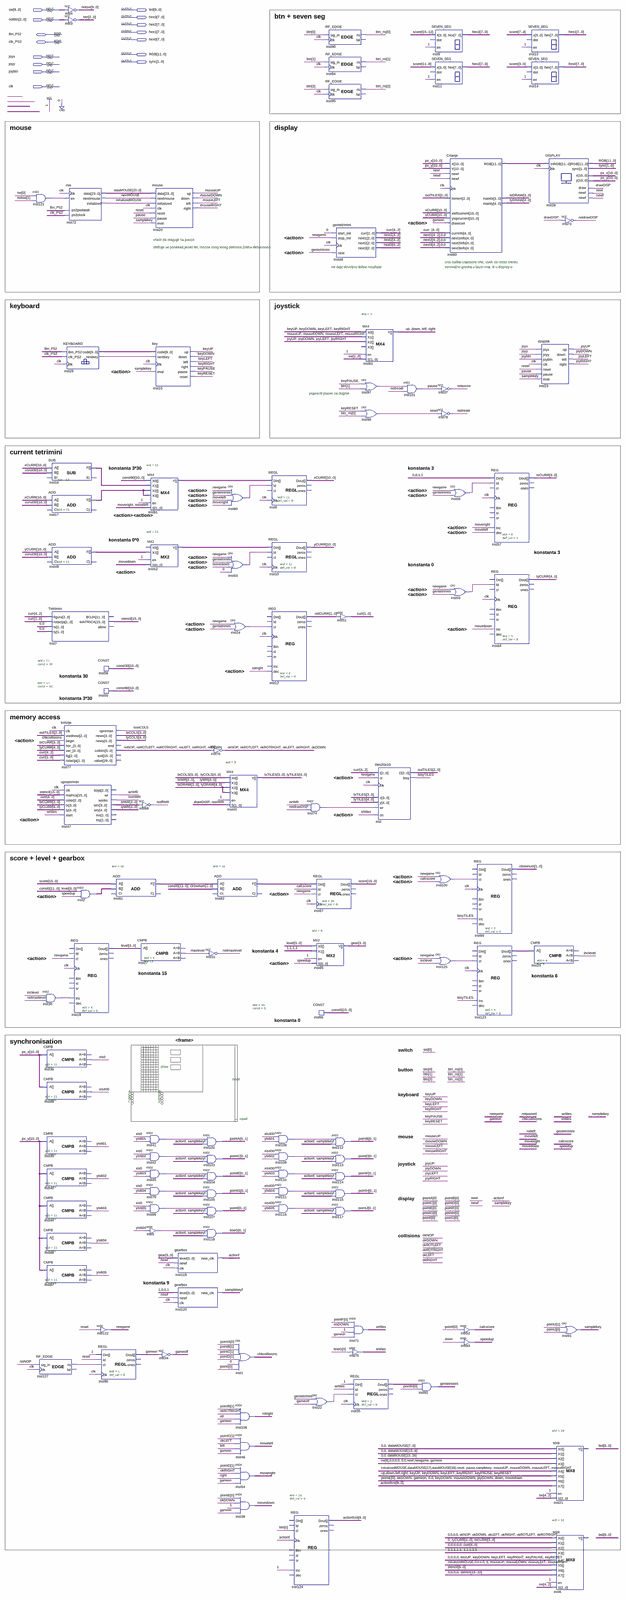
[diagram p0: schematic sheet, whole]
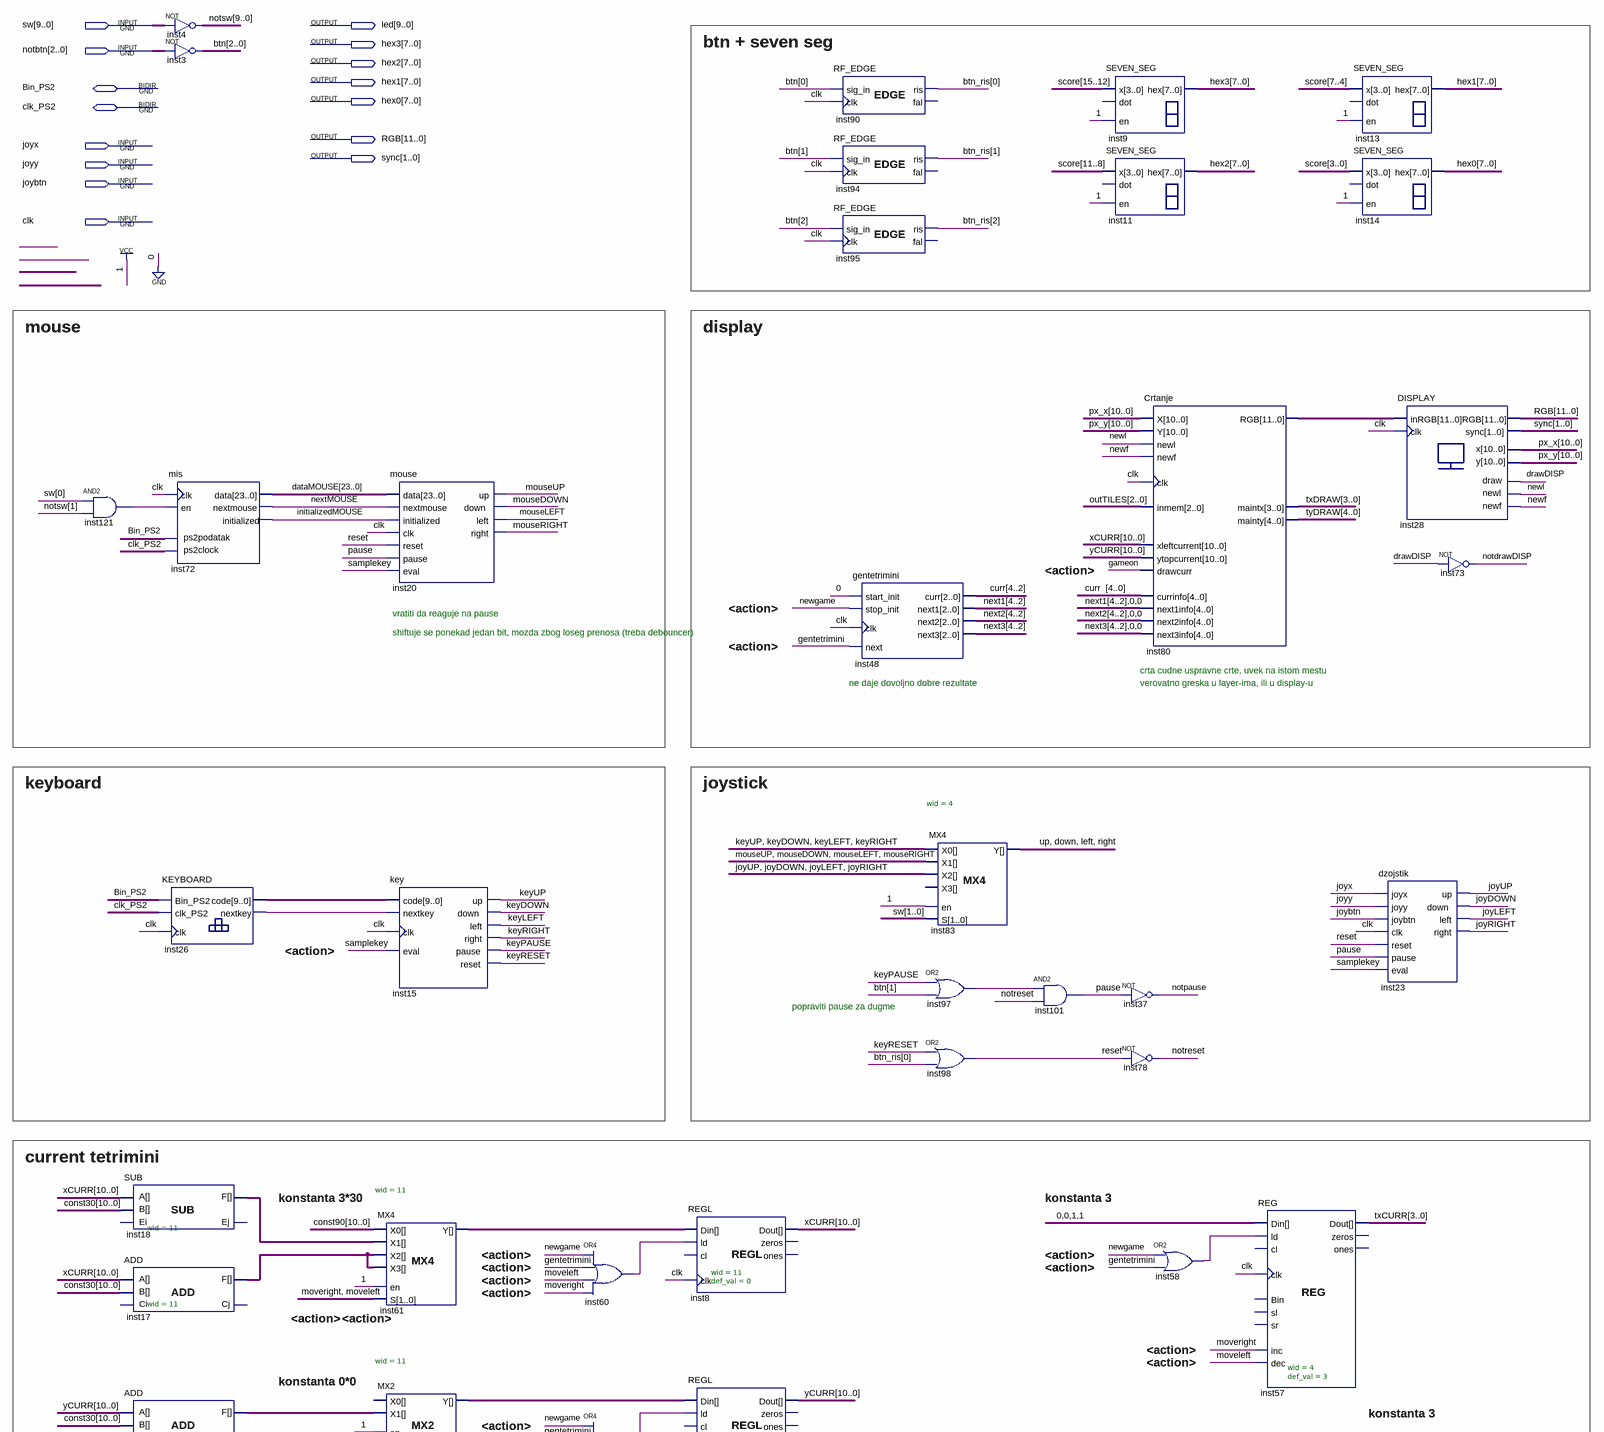
[diagram p1: schematic sheet, upper part]
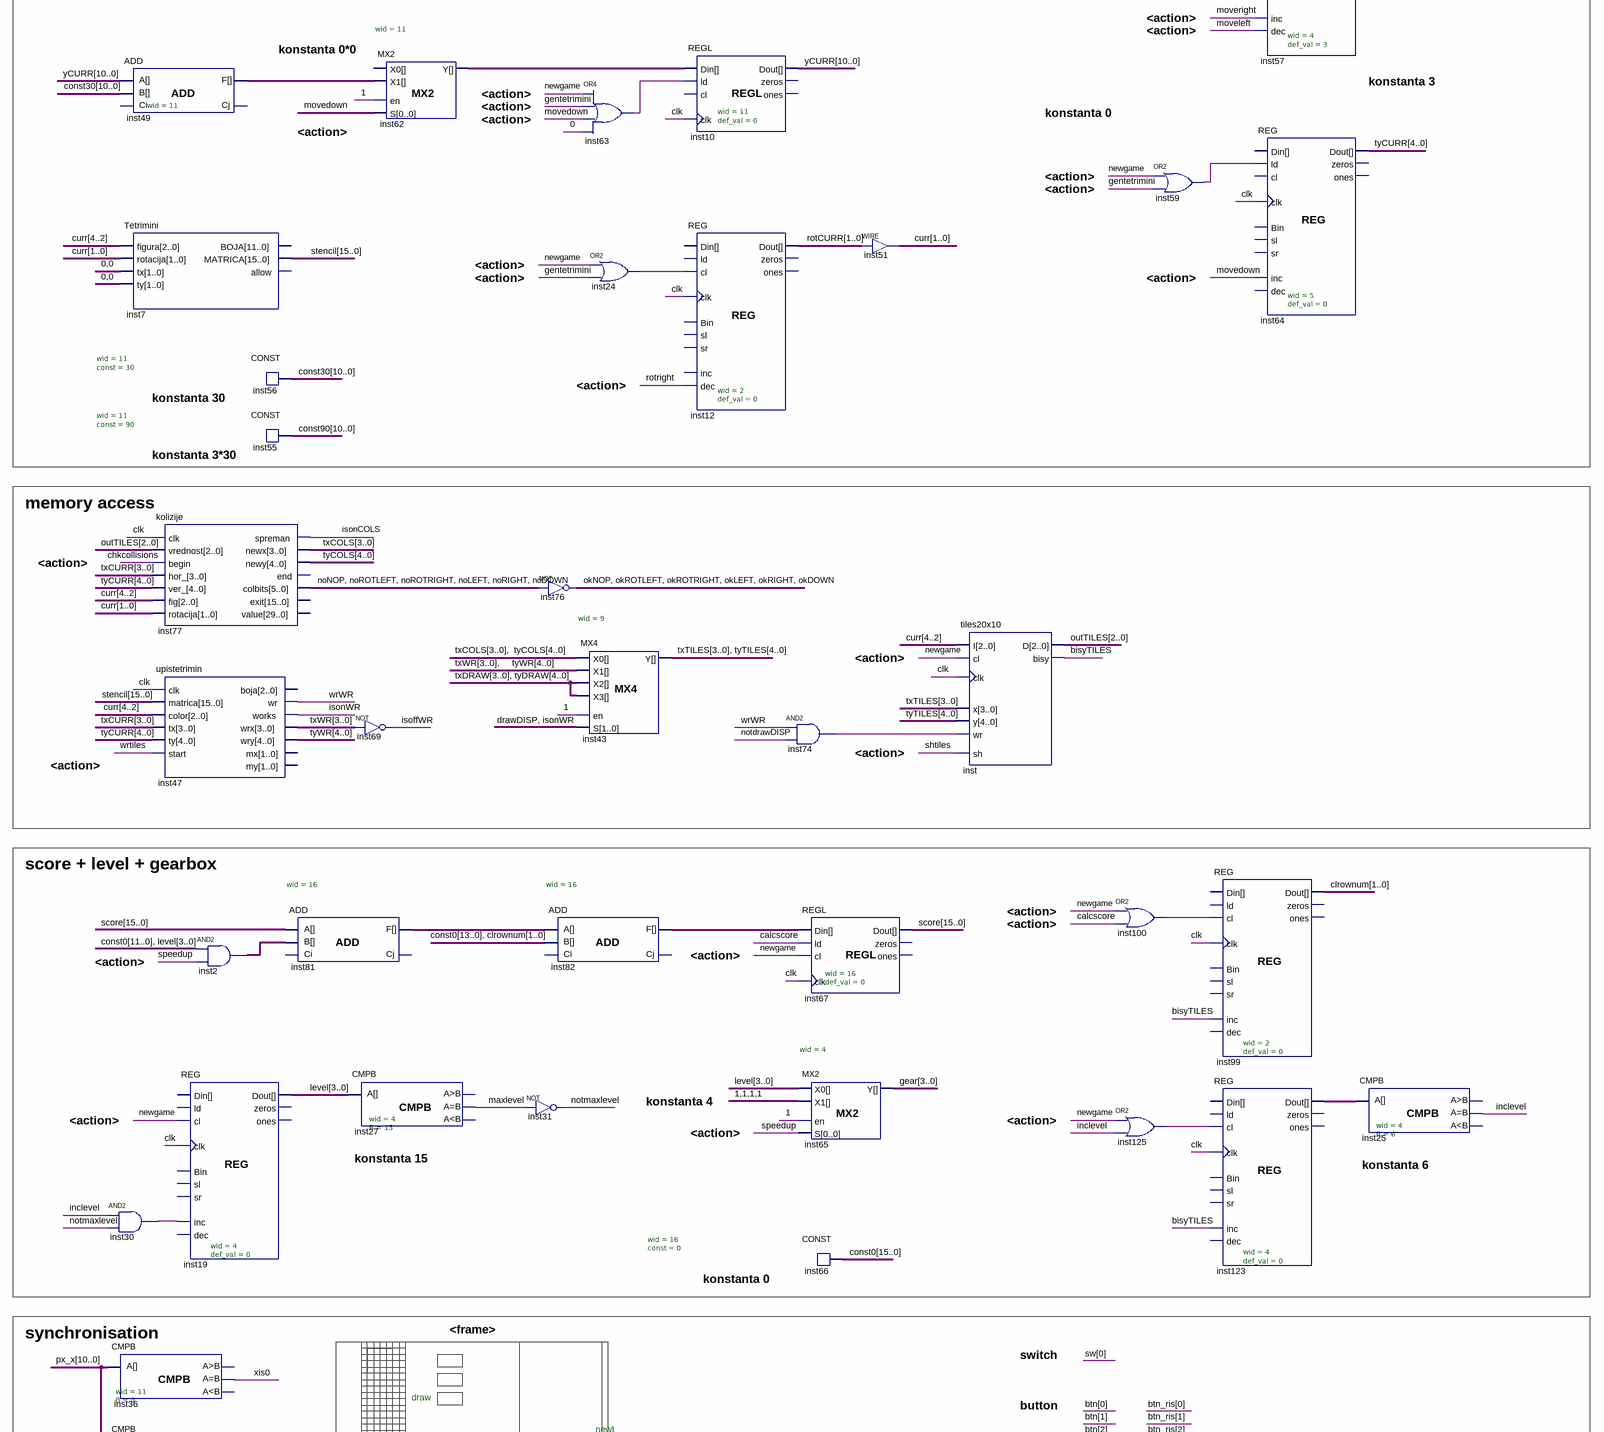
[diagram p2: schematic sheet, middle part]
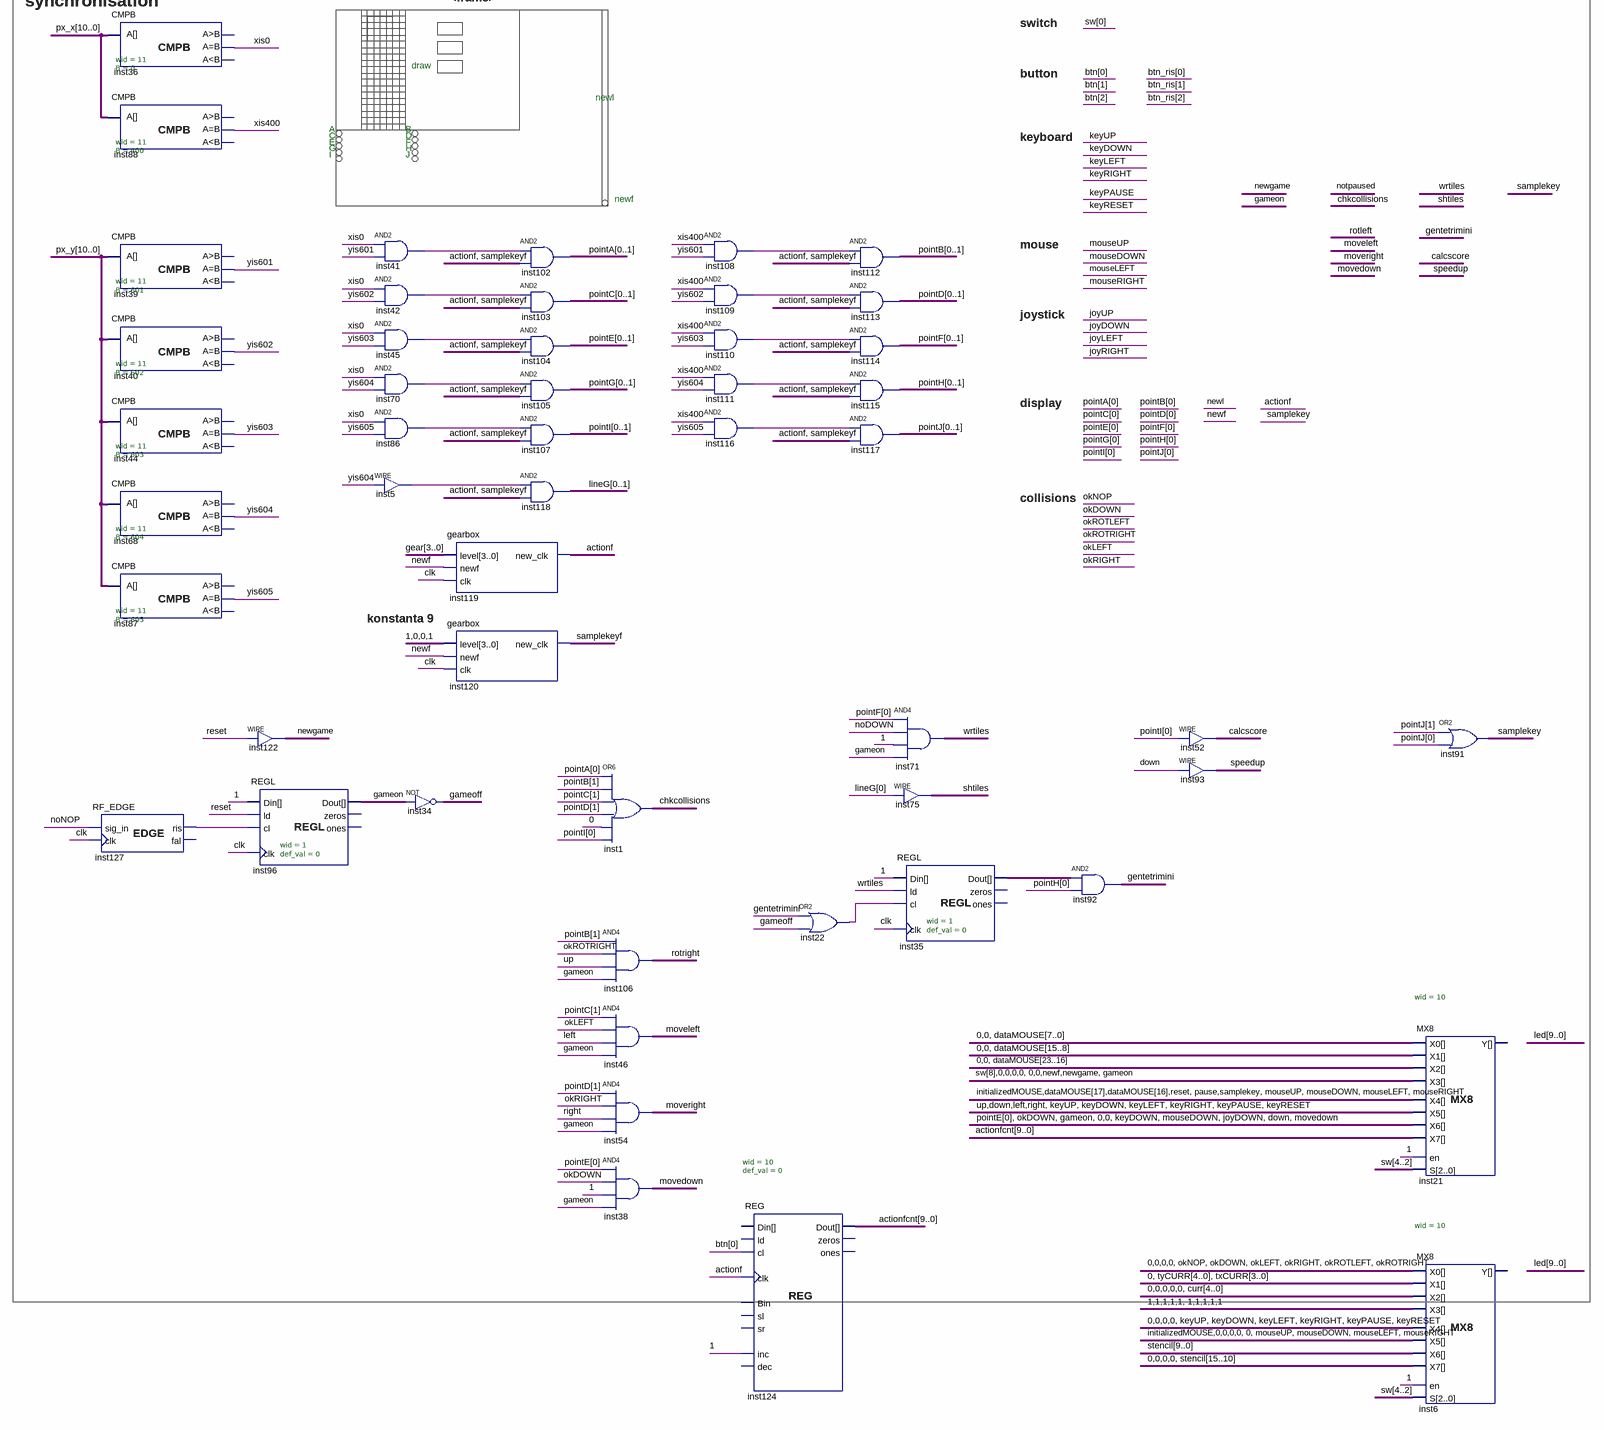
[diagram p3: schematic sheet, lower part]
// Quartus schematic main.bdf as structural Verilog: 117 symbols, 15 pins
module main (
  input  [9:0] sw,
  input  [2:0] notbtn,
  input  joyx,
  input  joyy,
  input  joybtn,
  input  clk,
  inout  Bin_PS2,
  inout  clk_PS2,
  output [9:0] led,
  output [7:0] hex3,
  output [7:0] hex2,
  output [7:0] hex1,
  output [7:0] hex0,
  output [11:0] RGB,
  output [1:0] sync
);

  wire actionf, bisyTILES, calcscore, chkcollisions, down, drawDISP, gameoff, gameon, gentetrimini, inclevel,
       initializedMOUSE, inst5_out, inst22_out, inst24_out, inst26_nextkey, inst30_out, inst35_dout,
       inst41_out, inst42_out, inst45_out, inst58_out, inst59_out, inst60_out, inst63_out, inst70_out,
       inst74_out, inst86_out, inst97_out, inst100_out, inst108_out, inst109_out, inst110_out, inst111_out,
       inst116_out, inst121_out, inst125_out, inst127_ris, isoffWR, isonCOLS, isonWR, joyDOWN, joyLEFT,
       joyRIGHT, joyUP, keyDOWN, keyLEFT, keyPAUSE, keyRESET, keyRIGHT, keyUP, left, maxlevel, mouseDOWN,
       mouseLEFT, mouseRIGHT, mouseUP, movedown, moveleft, moveright, newf, newgame, newl, nextMOUSE, noDOWN,
       noLEFT, noNOP, noRIGHT, noROTLEFT, noROTRIGHT, notdrawDISP, notmaxlevel, notpause, notreset, okDOWN,
       okLEFT, okNOP, okRIGHT, okROTLEFT, okROTRIGHT, pause, reset, right, rotright, samplekey, samplekeyf,
       shtiles, speedup, up, wrtiles, wrWR, xis0, xis400, yis601, yis602, yis603, yis604, yis605;
  wire [1:0] clrownum, lineG, pointA, pointB, pointC, pointD, pointE, pointF, pointG, pointH, pointI, pointJ,
       rotCURR;
  wire [2:0] btn, btn_ris, outTILES;
  wire [3:0] gear, inst123_dout, level, txCOLS, txCURR, txDRAW, txTILES, txWR;
  wire [4:0] curr, tyCOLS, tyCURR, tyDRAW, tyTILES, tyWR;
  wire [4:2] next1, next2, next3;
  wire [9:0] actionfcnt, inst26_code, notsw;
  wire [10:0] const30, const90, inst17_f, inst18_f, inst49_f, inst61_y, inst62_y, px_x, px_y, xCURR, yCURR;
  wire [11:0] inst80_rgb;
  wire [15:0] const0, inst2_out, inst81_f, inst82_f, score, stencil;
  wire [23:0] dataMOUSE;

  and inst121 (inst121_out, sw[0], notsw[1]);
  RF_EDGE inst127 (.sig_in(noNOP), .clk(clk), .ris(inst127_ris));  // open: fal
  SUB #(.wid(11)) inst18 (.A(xCURR), .B(const30), .F(inst18_f));  // open: Ei, Ej
  ADD #(.wid(11)) inst17 (.A(xCURR), .B(const30), .F(inst17_f));  // open: Ci, Cj
  ADD #(.wid(11)) inst49 (.A(yCURR), .B(const30), .F(inst49_f));  // open: Ci, Cj
  Tetrimini inst7 (
    .figura(curr[4:2]), .rotacija(curr[1:0]), .tx(2'b00), .ty(2'b00), .MATRICA(stencil));  // open: BOJA, allow
  kolizije inst77 (
    .clk(clk), .vrednost(outTILES), .\begin (chkcollisions), .hor_(txCURR), .ver_(tyCURR), .fig(curr[4:2]),
    .rotacija(curr[1:0]), .spreman(isonCOLS), .newx(txCOLS), .newy(tyCOLS),
    .colbits({noNOP, noROTLEFT, noROTRIGHT, noLEFT, noRIGHT, noDOWN}));  // open: end, exit, value
  upistetrimin inst47 (
    .clk(clk), .matrica(stencil), .color(curr[4:2]), .tx(txCURR), .ty(tyCURR), .start(wrtiles), .wr(wrWR),
    .works(isonWR), .wrx(txWR), .wry(tyWR));  // open: boja, mx, my
  and inst30 (inst30_out, inclevel, notmaxlevel);
  CMPB #(.wid(11), .B(0)) inst36 (.A(px_x), .eq(xis0));  // open: gr, ls
  CMPB #(.wid(11), .B(400)) inst88 (.A(px_x), .eq(xis400));  // open: gr, ls
  CMPB #(.wid(11), .B(601)) inst39 (.A(px_y), .eq(yis601));  // open: gr, ls
  CMPB #(.wid(11), .B(602)) inst40 (.A(px_y), .eq(yis602));  // open: gr, ls
  CMPB #(.wid(11), .B(603)) inst44 (.A(px_y), .eq(yis603));  // open: gr, ls
  CMPB #(.wid(11), .B(604)) inst68 (.A(px_y), .eq(yis604));  // open: gr, ls
  CMPB #(.wid(11), .B(605)) inst87 (.A(px_y), .eq(yis605));  // open: gr, ls
  assign notsw = ~sw;  // NOT inst4, 10 bits wide
  assign btn = ~notbtn;  // NOT inst3, 3 bits wide
  mis inst72 (
    .en(inst121_out), .clk(clk), .data(dataMOUSE), .nextmouse(nextMOUSE), .initialized(initializedMOUSE),
    .ps2podatak(Bin_PS2), .ps2clock(clk_PS2));
  KEYBOARD inst26 (.Bin_PS2(Bin_PS2), .clk_PS2(clk_PS2), .clk(clk), .code(inst26_code), .nextkey(inst26_nextkey));
  assign inst2_out = {const0[11:0], level} & {16{speedup}};  // AND2 inst2, 16 bits wide
  REG #(.wid(4), .def_val(0)) inst19 (
    .cl(newgame), .clk(clk), .inc(inst30_out), .Dout(level));  // open: ld, Bin, sl, sr, dec, Din, zeros, ones
  CONST #(.wid(11), .\const (30)) inst56 (.data(const30));
  CONST #(.wid(11), .\const (90)) inst55 (.data(const90));
  assign newgame = reset;  // WIRE inst122
  REGL #(.wid(1), .def_val(0)) inst96 (
    .Din(1'b1), .ld(reset), .cl(inst127_ris), .clk(clk), .Dout(gameon));  // open: zeros, ones
  ADD #(.wid(16)) inst81 (.A(score), .B(inst2_out), .F(inst81_f));  // open: Ci, Cj
  assign isoffWR = ~txWR;  // NOT inst69, 4 bits wide
  CMPB #(.wid(4), .B(15)) inst27 (.A(level), .eq(maxlevel));  // open: gr, ls
  mouse inst20 (
    .data(dataMOUSE), .nextmouse(nextMOUSE), .initialized(initializedMOUSE), .clk(clk), .reset(reset),
    .pause(pause), .eval(samplekey), .up(mouseUP), .down(mouseDOWN), .left(mouseLEFT), .right(mouseRIGHT));
  key inst15 (
    .code(inst26_code), .nextkey(inst26_nextkey), .eval(samplekey), .clk(clk), .up(keyUP), .down(keyDOWN),
    .left(keyLEFT), .right(keyRIGHT), .pause(keyPAUSE), .reset(keyRESET));
  MX4 #(.wid(11)) inst61 (
    .X0(const90), .X1(inst18_f), .X2(inst17_f), .X3(inst17_f), .en(1'b1), .S({moveright, moveleft}),
    .Y(inst61_y));
  MX2 #(.wid(11)) inst62 (.X1(inst49_f), .en(1'b1), .S(movedown), .Y(inst62_y));  // open: X0
  and inst41 (inst41_out, xis0, yis601);
  and inst42 (inst42_out, xis0, yis602);
  and inst45 (inst45_out, xis0, yis603);
  and inst70 (inst70_out, xis0, yis604);
  and inst86 (inst86_out, xis0, yis605);
  assign inst5_out = yis604;  // WIRE inst5
  not inst34 (gameoff, gameon);
  gearbox inst119 (.level(gear), .newf(newf), .clk(clk), .new_clk(actionf));
  gearbox inst120 (.level(4'b1001), .newf(newf), .clk(clk), .new_clk(samplekeyf));
  assign {okNOP, okROTLEFT, okROTRIGHT, okLEFT, okRIGHT, okDOWN} = ~{noNOP, noROTLEFT, noROTRIGHT, noLEFT, noRIGHT, noDOWN};  // NOT inst76, 6 bits wide
  ADD #(.wid(16)) inst82 (.A(inst81_f), .B({const0[13:0], clrownum}), .F(inst82_f));  // open: Ci, Cj
  not inst31 (notmaxlevel, maxlevel);
  assign {pointA[0], pointA[1]} = {2{inst41_out}} & {actionf, samplekeyf};  // AND2 inst102, 2 bits wide
  assign {pointC[0], pointC[1]} = {2{inst42_out}} & {actionf, samplekeyf};  // AND2 inst103, 2 bits wide
  assign {pointE[0], pointE[1]} = {2{inst45_out}} & {actionf, samplekeyf};  // AND2 inst104, 2 bits wide
  assign {pointG[0], pointG[1]} = {2{inst70_out}} & {actionf, samplekeyf};  // AND2 inst105, 2 bits wide
  assign {pointI[0], pointI[1]} = {2{inst86_out}} & {actionf, samplekeyf};  // AND2 inst107, 2 bits wide
  assign {lineG[0], lineG[1]} = {2{inst5_out}} & {actionf, samplekeyf};  // AND2 inst118, 2 bits wide
  or inst60 (inst60_out, newgame, gentetrimini, moveleft, moveright);
  or inst63 (inst63_out, newgame, gentetrimini, movedown, 1'b0);
  or inst24 (inst24_out, newgame, gentetrimini);
  MX4 #(.wid(9)) inst43 (
    .X0({txCOLS, tyCOLS}), .X1({txWR, tyWR}), .X2({txDRAW, tyDRAW}), .X3({txDRAW, tyDRAW}), .en(1'b1),
    .S({drawDISP, isonWR}), .Y({txTILES, tyTILES}));
  or inst1 (chkcollisions, pointA[0], pointB[1], pointC[1], pointD[1], 1'b0, pointI[0]);
  and inst106 (rotright, pointB[1], okROTRIGHT, up, gameon);
  and inst46 (moveleft, pointC[1], okLEFT, left, gameon);
  and inst54 (moveright, pointD[1], okRIGHT, right, gameon);
  and inst38 (movedown, pointE[0], okDOWN, 1'b1, gameon);
  REGL #(.wid(11), .def_val(0)) inst8 (
    .Din(inst61_y), .ld(inst60_out), .clk(clk), .Dout(xCURR));  // open: cl, zeros, ones
  REGL #(.wid(11), .def_val(0)) inst10 (
    .Din(inst62_y), .ld(inst63_out), .clk(clk), .Dout(yCURR));  // open: cl, zeros, ones
  REG #(.wid(2), .def_val(0)) inst12 (
    .cl(inst24_out), .clk(clk), .dec(rotright), .Dout(rotCURR));  // open: ld, Bin, sl, sr, inc, Din, zeros, ones
  and inst108 (inst108_out, xis400, yis601);
  and inst109 (inst109_out, xis400, yis602);
  and inst110 (inst110_out, xis400, yis603);
  and inst111 (inst111_out, xis400, yis604);
  and inst116 (inst116_out, xis400, yis605);
  REG #(.wid(10), .def_val(0)) inst124 (
    .cl(btn[0]), .clk(actionf), .inc(1'b1), .Dout(actionfcnt));  // open: ld, Bin, sl, sr, dec, Din, zeros, ones
  and inst74 (inst74_out, wrWR, notdrawDISP);
  REGL #(.wid(16), .def_val(0)) inst67 (
    .Din(inst82_f), .ld(calcscore), .cl(newgame), .clk(clk), .Dout(score));  // open: zeros, ones
  MX2 #(.wid(4)) inst65 (.X0(level), .X1(4'b1111), .en(1'b1), .S(speedup), .Y(gear));
  CONST #(.wid(16), .\const (0)) inst66 (.data(const0));
  or inst22 (inst22_out, gentetrimini, gameoff);
  RF_EDGE inst90 (.sig_in(btn[0]), .clk(clk), .ris(btn_ris[0]));  // open: fal
  RF_EDGE inst94 (.sig_in(btn[1]), .clk(clk), .ris(btn_ris[1]));  // open: fal
  RF_EDGE inst95 (.sig_in(btn[2]), .clk(clk), .ris(btn_ris[2]));  // open: fal
  gentetrimini inst48 (
    .start_init(1'b0), .stop_init(newgame), .clk(clk), .next(gentetrimini), .curr(curr[4:2]), .next1(next1),
    .next2(next2), .next3(next3));
  assign curr[1:0] = rotCURR;  // WIRE inst51
  assign {pointB[0], pointB[1]} = {2{inst108_out}} & {actionf, samplekeyf};  // AND2 inst112, 2 bits wide
  assign {pointD[0], pointD[1]} = {2{inst109_out}} & {actionf, samplekeyf};  // AND2 inst113, 2 bits wide
  assign {pointF[0], pointF[1]} = {2{inst110_out}} & {actionf, samplekeyf};  // AND2 inst114, 2 bits wide
  assign {pointH[0], pointH[1]} = {2{inst111_out}} & {actionf, samplekeyf};  // AND2 inst115, 2 bits wide
  assign {pointJ[0], pointJ[1]} = {2{inst116_out}} & {actionf, samplekeyf};  // AND2 inst117, 2 bits wide
  and inst71 (wrtiles, pointF[0], noDOWN, 1'b1, gameon);
  assign shtiles = lineG[0];  // WIRE inst75
  REGL #(.wid(1), .def_val(0)) inst35 (
    .Din(1'b1), .ld(wrtiles), .cl(inst22_out), .clk(clk), .Dout(inst35_dout));  // open: zeros, ones
  MX4 #(.wid(4)) inst83 (
    .X0({keyUP, keyDOWN, keyLEFT, keyRIGHT}), .X1({mouseUP, mouseDOWN, mouseLEFT, mouseRIGHT}),
    .X2({joyUP, joyDOWN, joyLEFT, joyRIGHT}), .en(1'b1), .S(sw[1:0]), .Y({up, down, left, right}));  // open: X3
  or inst97 (inst97_out, keyPAUSE, btn[1]);
  or inst98 (reset, keyRESET, btn_ris[0]);
  tiles20x10 inst (
    .I(curr[4:2]), .cl(newgame), .clk(clk), .x(txTILES), .y(tyTILES), .wr(inst74_out), .sh(shtiles),
    .D(outTILES), .bisy(bisyTILES));
  and inst101 (pause, inst97_out, notreset);
  SEVEN_SEG inst9 (.x(score[15:12]), .en(1'b1), .hex(hex3));  // open: dot
  SEVEN_SEG inst11 (.x(score[11:8]), .en(1'b1), .hex(hex2));  // open: dot
  or inst100 (inst100_out, newgame, calcscore);
  or inst125 (inst125_out, newgame, inclevel);
  and inst92 (gentetrimini, inst35_dout, pointH[0]);
  Crtanje inst80 (
    .X(px_x), .Y(px_y), .newl(newl), .newf(newf), .clk(clk), .inmem(outTILES), .xleftcurrent(xCURR),
    .ytopcurrent(yCURR), .drawcurr(gameon), .currinfo(curr), .next1info({next1, 2'b00}),
    .next2info({next2, 2'b00}), .next3info({next3, 2'b00}), .RGB(inst80_rgb), .maintx(txDRAW), .mainty(tyDRAW));
  not inst37 (notpause, pause);
  not inst78 (notreset, reset);
  or inst58 (inst58_out, newgame, gentetrimini);
  or inst59 (inst59_out, newgame, gentetrimini);
  REG #(.wid(2), .def_val(0)) inst99 (
    .cl(inst100_out), .clk(clk), .inc(bisyTILES), .Dout(clrownum));  // open: ld, Bin, sl, sr, dec, Din, zeros, ones
  REG #(.wid(4), .def_val(0)) inst123 (
    .cl(inst125_out), .clk(clk), .inc(bisyTILES), .Dout(inst123_dout));  // open: ld, Bin, sl, sr, dec, Din, zeros, ones
  assign calcscore = pointI[0];  // WIRE inst52
  assign speedup = down;  // WIRE inst93
  REG #(.wid(4), .def_val(3)) inst57 (
    .ld(inst58_out), .clk(clk), .inc(moveright), .dec(moveleft), .Din(4'b0011), .Dout(txCURR));  // open: cl, Bin, sl, sr, zeros, ones
  REG #(.wid(5), .def_val(0)) inst64 (
    .ld(inst59_out), .clk(clk), .inc(movedown), .Dout(tyCURR));  // open: cl, Bin, sl, sr, dec, Din, zeros, ones
  SEVEN_SEG inst13 (.x(score[7:4]), .en(1'b1), .hex(hex1));  // open: dot
  SEVEN_SEG inst14 (.x(score[3:0]), .en(1'b1), .hex(hex0));  // open: dot
  CMPB #(.wid(4), .B(6)) inst25 (.A(inst123_dout), .eq(inclevel));  // open: gr, ls
  DISPLAY inst28 (
    .inRGB(inst80_rgb), .clk(clk), .RGB(RGB), .sync(sync), .x(px_x), .y(px_y), .draw(drawDISP), .newl(newl),
    .newf(newf));
  dzojstik inst23 (
    .joyx(joyx), .joyy(joyy), .joybtn(joybtn), .clk(clk), .reset(reset), .pause(pause), .eval(samplekey),
    .up(joyUP), .down(joyDOWN), .left(joyLEFT), .right(joyRIGHT));
  MX8 #(.wid(10)) inst21 (
    .X0({2'b00, dataMOUSE[7:0]}), .X1({2'b00, dataMOUSE[15:8]}), .X2({2'b00, dataMOUSE[23:16]}),
    .X3({sw[8], {6{1'b0}}, newf, newgame, gameon}),
    .X4({initializedMOUSE, dataMOUSE[17:16], reset, pause, samplekey, mouseUP, mouseDOWN, mouseLEFT, mouseRIGHT}),
    .X5({up, down, left, right, keyUP, keyDOWN, keyLEFT, keyRIGHT, keyPAUSE, keyRESET}),
    .X6({pointE[0], okDOWN, gameon, 2'b00, keyDOWN, mouseDOWN, joyDOWN, down, movedown}), .X7(actionfcnt),
    .en(1'b1), .S(sw[4:2]));  // open: Y
  MX8 #(.wid(10)) inst6 (
    .X0({4'b0000, okNOP, okDOWN, okLEFT, okRIGHT, okROTLEFT, okROTRIGHT}), .X1({1'b0, tyCURR, txCURR}),
    .X2({{5{1'b0}}, curr}), .X3({10{1'b1}}),
    .X4({4'b0000, keyUP, keyDOWN, keyLEFT, keyRIGHT, keyPAUSE, keyRESET}),
    .X5({initializedMOUSE, {5{1'b0}}, mouseUP, mouseDOWN, mouseLEFT, mouseRIGHT}), .X6(stencil[9:0]),
    .X7({4'b0000, stencil[15:10]}), .en(1'b1), .S(sw[4:2]));  // open: Y
  not inst73 (notdrawDISP, drawDISP);
  or inst91 (samplekey, pointJ[1], pointJ[0]);

  // Notes on the sheet:
  //   btn + seven seg
  //   mouse
  //   display
  //   <action>
  //   <action>
  //   vratiti da reaguje na pause
  //   shiftuje se ponekad jedan bit, mozda zbog loseg prenosa (treba debouncer)
  //   <action>
  //   crta cudne uspravne crte, uvek na istom mestu
  //   ne daje dovoljno dobre rezultate
  //   verovatno greska u layer-ima, ili u display-u
  //   keyboard
  //   joystick
  //   <action>
  //   popraviti pause za dugme
  //   current tetrimini
  //   konstanta 3*30
  //   konstanta 3
  //   <action>
  //   <action>
  //   <action>
  //   <action>
  //   <action>
  //   <action>
  //   <action>
  //   <action>
  //   <action>
  //   <action>
  //   konstanta 0*0
  //   konstanta 3
  //   <action>
  //   <action>
  //   konstanta 0
  //   <action>
  //   <action>
  //   <action>
  //   <action>
  //   <action>
  //   <action>
  //   <action>
  //   <action>
  //   konstanta 30
  //   konstanta 3*30
  //   memory access
  //   <action>
  //   <action>
  //   <action>
  //   <action>
  //   score + level + gearbox
  //   <action>
  //   <action>
  //   <action>
  //   <action>
  //   konstanta 4
  //   <action>
  //   <action>
  //   <action>
  //   konstanta 15
  //   konstanta 6
  //   konstanta 0
  //   synchronisation
  //   <frame>
  //   switch
  //   draw
  //   button
  //   newl
  //   A
  //   B
  //   C
  //   D
  //   keyboard
  //   E
  //   F
  //   G
  //   H
  //   I
  //   J
  //   newf
  //   mouse
  //   joystick
  //   display
  //   collisions
  //   konstanta 9
endmodule
